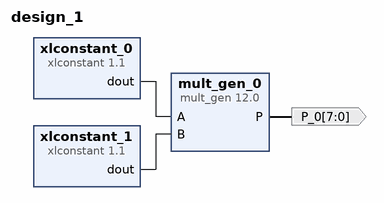
[diagram p0: block diagram of the top level]
# Vivado block design design_1, xc7a35tcpg236-1, Vivado 2024.1
create_bd_design design_1

create_bd_port -dir O -from 7 -to 0 -type data P_0

create_bd_cell -type ip -vlnv xilinx.com:ip:mult_gen:12.0 mult_gen_0
set_property -dict [list \
  CONFIG.PipeStages 0 \
  CONFIG.PortAType Unsigned \
  CONFIG.PortAWidth 4 \
  CONFIG.PortBType Unsigned \
  CONFIG.PortBWidth 4 \
] [get_bd_cells mult_gen_0]
create_bd_cell -type ip -vlnv xilinx.com:ip:xlconstant:1.1 xlconstant_0
set_property -dict {CONFIG.CONST_VAL 8 CONFIG.CONST_WIDTH 4} [get_bd_cells xlconstant_0]
create_bd_cell -type ip -vlnv xilinx.com:ip:xlconstant:1.1 xlconstant_1
set_property -dict {CONFIG.CONST_VAL 9 CONFIG.CONST_WIDTH 4} [get_bd_cells xlconstant_1]

# ---- connections ----

connect_bd_net [get_bd_pins mult_gen_0/P] [get_bd_ports P_0]
connect_bd_net [get_bd_pins xlconstant_0/dout] [get_bd_pins mult_gen_0/A]
connect_bd_net [get_bd_pins xlconstant_1/dout] [get_bd_pins mult_gen_0/B]

validate_bd_design
save_bd_design
